# Altium schematic sheet 04_MCU.SchDoc
size A3; SheetNumber: 4; SheetTotal: 6
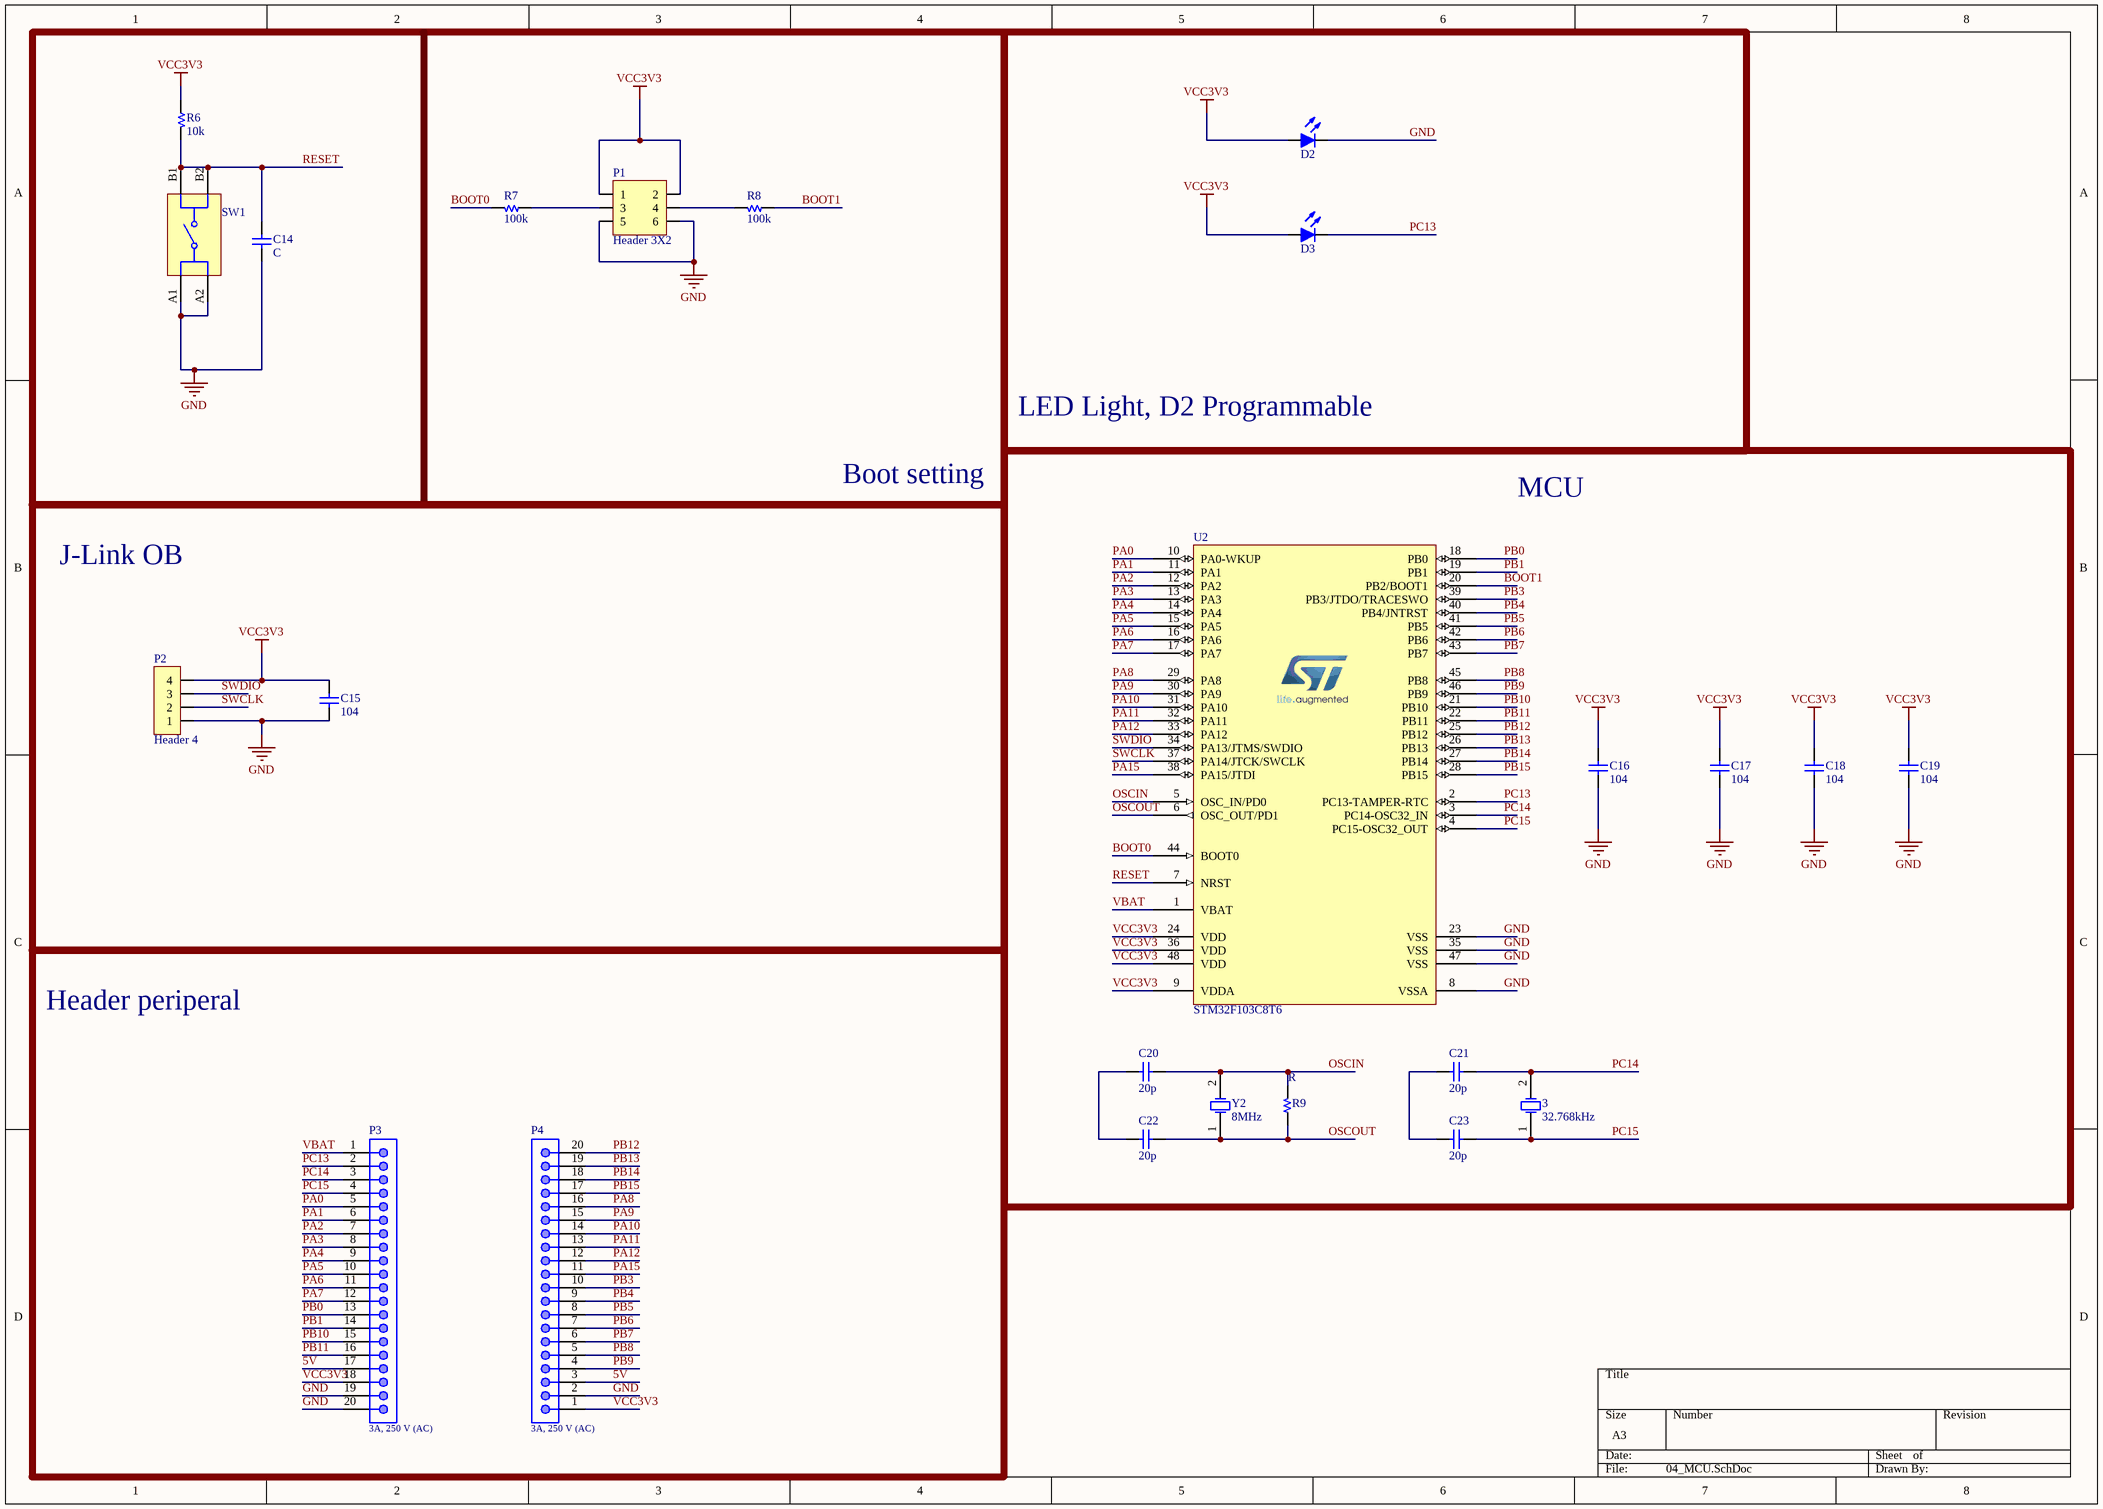
[diagram p0: 04_MCU.SchDoc]

## Parts
3  32.768kHz  [XKXGI-SUA-32.768K]
C14  C  [C 0603]
C15  104  [C 0805]
C16  104  [C 0805]
C17  104  [C 0805]
C18  104  [C 0805]
C19  104  [C 0805]
C20  20p  [C 0805]
C21  20p  [C 0805]
C22  20p  [C 0805]
C23  20p  [C 0805]
D2  Led  [Led 0805]  (value not drawn)
D3  Led  [Led 0805]  (value not drawn)
P1  Header 3X2  [HDR/Header/6/DL]
P2  Header 4  [HDR/Header/4]
P3  3A, 250 V (AC)  [61302011121]
P4  3A, 250 V (AC)  [61302011121]
R6  10k  [R 0805]
R7  100k  [R 0805]
R8  100k  [R 0805]
R9  R  [R 0805]
SW1  430152043826  [WS-TASV_L6W6H4.3_4301x20438x6]  (value not drawn)
U2  STM32F103C8T6  [STM32F103C8T6]
Y2  8MHz  [WE-XTAL_HC49/4HSMX]

## Blocks framed on the sheet
Boot setting: C14 P1 R6-R8 SW1
LED Light, D2 Programmable: D2 D3
MCU: 3 C16-C23 R9 U2 Y2
Header periperal: P3 P4

## Nets
GND: C14.2 C15.2 C16.1 C17.1 C18.1 C19.1 D2.2(K) P1.5 P1.6 P2.1 P3.19 P3.20 P4.2 SW1.A1 SW1.A2 U2.8(VSSA) U2.23(VSS) U2.35(VSS) U2.47(VSS)
VCC3V3: C15.1 C16.2 C17.2 C18.2 C19.2 D2.1(A) D3.1(A) P1.1 P1.2 P2.4 P3.18 P4.1 R6.1 U2.9(VDDA) U2.24(VDD) U2.36(VDD) U2.48(VDD)
5V: P3.17 P4.3
BOOT0: R7.2 U2.44(BOOT0)
BOOT1: R8.1 U2.20(PB2/BOOT1)
OSCIN: C20.1 R9.2 U2.5(OSC_IN/PD0) Y2.2(OSC2)
OSCOUT: C22.1 R9.1 U2.6(OSC_OUT/PD1) Y2.1(OSC1)
PA0: P3.5 U2.10(PA0-WKUP)
PA1: P3.6 U2.11(PA1)
PA2: P3.7 U2.12(PA2)
PA3: P3.8 U2.13(PA3)
PA4: P3.9 U2.14(PA4)
PA5: P3.10 U2.15(PA5)
PA6: P3.11 U2.16(PA6)
PA7: P3.12 U2.17(PA7)
PA8: P4.16 U2.29(PA8)
PA9: P4.15 U2.30(PA9)
PA10: P4.14 U2.31(PA10)
PA11: P4.13 U2.32(PA11)
PA12: P4.12 U2.33(PA12)
PA15: P4.11 U2.38(PA15/JTDI)
PB0: P3.13 U2.18(PB0)
PB1: P3.14 U2.19(PB1)
PB3: P4.10 U2.39(PB3/JTDO/TRACESWO)
PB4: P4.9 U2.40(PB4/JNTRST)
PB5: P4.8 U2.41(PB5)
PB6: P4.7 U2.42(PB6)
PB7: P4.6 U2.43(PB7)
PB8: P4.5 U2.45(PB8)
PB9: P4.4 U2.46(PB9)
PB10: P3.15 U2.21(PB10)
PB11: P3.16 U2.22(PB11)
PB12: P4.20 U2.25(PB12)
PB13: P4.19 U2.26(PB13)
PB14: P4.18 U2.27(PB14)
PB15: P4.17 U2.28(PB15)
PC13: D3.2(K) P3.2 U2.2(PC13-TAMPER-RTC)
PC14: 3.2(OSC2) C21.1 P3.3 U2.3(PC14-OSC32_IN)
PC15: 3.1(OSC1) C23.1 P3.4 U2.4(PC15-OSC32_OUT)
RESET: C14.1 R6.2 SW1.B1 SW1.B2 U2.7(NRST)
SWCLK: P2.2 U2.37(PA14/JTCK/SWCLK)
SWDIO: P2.3 U2.34(PA13/JTMS/SWDIO)
VBAT: P3.1 U2.1(VBAT)
NetC20_2: C20.2 C22.2
NetC21_2: C21.2 C23.2
NetP1_3: P1.3 R7.1
NetP1_4: P1.4 R8.2

## Notes on the sheet
- J-Link OB

## Library data of the parts
3 = XKXGI-SUA-32.768K: 32.768kHz Surface Mount Crystal 12.5pF ±20ppm ±30ppm SMD3215-2P Crystals ROHS; Manufacturer: YXC Crystal Oscillators; Frequency Stability: +/-30ppm; Frequency Tolerance: +/-20ppm; ComponentLink1Description: Datasheet; ComponentLink1URL: https://www.lcsc.com/datasheet/lcsc_datasheet_2210261730_YXC-Crystal-Oscillators-XKXGI-SUA-32-768K_C5213671.pdf; Frequency: 32.768kHz; LCSC Part #: C5213671; Load Capacitance: 12.5pF; Manufacturer Part Number: XKXGI-SUA-32.768K; Mount: SMD/SMT; Operating Temperature Max: + 85 C; Operating Temperature Min: - 40 C; Package / Case: SMD3215-2P; Packaging: Tape and Reel; Supplier 1: Mouser; Supplier 1 Part Number: N/A; Supplier 1 URL: N/A; Supplier 2: Digi-Key; Supplier 2 Part Number: N/A; Supplier 2 URL: N/A; Supplier 3: thegioiic; Supplier 3 Part Number: N/A; Supplier 3 URL: N/A; Value: 32.768kHz
C14-C23 = Capacitor NP: Capacitor non-pol
D2 D3 = Led: Typical LED
P1 = Header 3X2: Header, 3-Pin, Dual row
P2 = Header 4: Header, 4-Pin
P3 P4 = 61302011121: WR-PHD Pin Header, THT, pitch 2.54mm, Single Row, Vertical, 20p; Manufacturer: Wurth Elektronik; Pin Number: 20; Working Voltage: 250VAC; Withstanding Voltage: 500VAC; Contact Resistance: 20mOhm; ComponentLink1Description: Datasheet; ComponentLink1URL: https://www.we-online.com/catalog/datasheet/61302011121.pdf; Manufacturer Part Number: 61302011121; Published Date: May 2020; Pitch: 2.54mm; Packaging: Bag; Gender: Pin Header; Rated Current: 3A; Row Number: Single; Orientation: Vertical; Supplier 1 URL: https://www.mouser.vn/ProductDetail/Wurth-Elektronik/61302011121?qs=PhR8RmCirEbj%2FFsnpbhNaw%3D%3D; Supplier 2 URL: N/A; Supplier 3 URL: N/A; LCSC Part #: N/A; Mount: THT; Operating Temperature Max: + 85 C; Operating Temperature Min: - 25 C; Supplier 1: Mouser; Supplier 1 Part Number: 710-61302011121; Supplier 2: Digi-Key; Supplier 2 Part Number: N/A; Supplier 3: thegioiic; Supplier 3 Part Number: N/A; Value: 3A, 250 V (AC)
R6-R9 = Resistor
SW1 = 430152043826: WS-TASV SMT Tact Switch, L6 x W6 x H4.3mm, 260g, SPST-NO, 12V, 50mA; Manufacturer: Wurth Elektronik; Washable: No; Rated Voltage: 12VDC; Manufacturer Part Number: 430152043826; Category: Tact Switches; Match Code: WS-TASV; Mount: Surface Mount; Operating Temperature Max: 85°C; Operating Temperature Min: -40°C; Packaging: Tape and Reel; Length: 6mm; Width: 6mm; Height: 4.3mm; Circuit: SPST-NO; Contact Material: Stainless Steel; Operation Force: 260g; Rated Current: 50mA; Terminal Material: Copper Alloy; Terminal Plating: Silver; Supplier 1 URL: https://www.mouser.vn/ProductDetail/Wurth-Elektronik/430152043826?qs=wr8lucFkNMUjBcFj1giTsA%3D%3D; Supplier 2 URL: https://www.digikey.com/en/products/detail/w%C3%BCrth-elektronik/430152043826/5208994; Supplier 3 URL: https://www.thegioiic.com/nut-nhan-6x6mm-cao-4-3mm-4-chan-smd; LCSC Part #: N/A; ComponentLink1Description: Datasheet; ComponentLink1URL: https://www.we-online.com/redexpert/spec/430152043826?ad; Package / Case: 0805; Supplier 1: Mouser; Supplier 1 Part Number: 710-430152043826; Supplier 2: Digi-Key; Supplier 2 Part Number: 732-6991-2-ND; Supplier 3: thegioiic; Supplier 3 Part Number: OEM; Value: 430152043826
U2 = STM32F103C8T6: ARM Microcontrollers - MCU 32BIT Cortex M3 64KB 20KB RAM 2X12 ADC; Manufacturer: STMicroelectronics; Manufacturer Part Number: STM32F103C8T6TR; Pad count: 48; Supply Voltage - Max: 3.6 V; Supply Voltage - Min: 2 V; Part Number: STM32F103C8T6; Value: STM32F103C8T6; Supplier 1 URL: https://www.mouser.com/ProductDetail/STMicroelectronics/STM32F103C8T6?qs=bhCVus9SdFtq6kqxsU5%2FDA%3D%3D; Supplier 2 URL: https://www.digikey.com/en/products/detail/stmicroelectronics/stm32f103c8t6tr/2122442; Supplier 3 URL: https://www.thegioiic.com/stm32f103c8t6-32-bit-arm-cortex-m3-microcontroller-72mhz-64kb-flash-48-lqfp; Packaging: Tape and Reel; Supplier 1: Mouser; Supplier 1 Part Number: 511-STM32F103C8T6; Supplier 2: Digi-Key; Supplier 2 Part Number: 497-17666-2-ND; Supplier 3: thegioiic; Supplier 3 Part Number: STM32F103C8T6; Mount: SMD/SMT; Operating Temperature Max: + 85 C; Operating Temperature Min: - 40 C; Package / Case: LQFP48; ComponentLink1Description: Datasheet; ComponentLink1URL: https://www.mouser.com/datasheet/2/389/stm32f103c8-1851025.pdf; LCSC Part #: C8734
Y2 = 071105086016: WE-XTAL Quartz Crystal, SMT, HC49/4HSMX, 8MHz, +/-30ppm; Manufacturer Part Number: 830003151; Manufacturer: Wurth Elektronik; Frequency Stability: +/-50ppm; Load Capacitance: 16pF; Frequency: 8MHz; Frequency Tolerance: +/-30ppm; Supplier 3 URL: https://www.thegioiic.com/thach-anh-8mhz-2-chan-smd-hc49-s; ComponentLink1Description: Datasheet; ComponentLink1URL: https://katalog.we-online.com/pbs/datasheet/830003151.pdf; Supplier 1 URL: https://www.mouser.com/ProductDetail/Wurth-Elektronik/830003151?qs=2WXlatMagcHisY7XHApyYg%3D%3D; Supplier 2 URL: https://www.digikey.com/en/products/detail/w%C3%BCrth-elektronik/830003151/13979296; Value: 8MHz; Mount: SMD/SMT; Operating Temperature Max: + 60 C; Operating Temperature Min: - 10 C; Package / Case: HC49/4HSMX; Packaging: Tape and Reel; Supplier 1: Mouser; Supplier 1 Part Number: 710-830003151; Supplier 2: Digi-Key; Supplier 2 Part Number: 732-830003151TR-ND; Supplier 3: thegioiic; Supplier 3 Part Number: N/A